# EAGLE design BoardV1 (EAGLE 9.5.0)
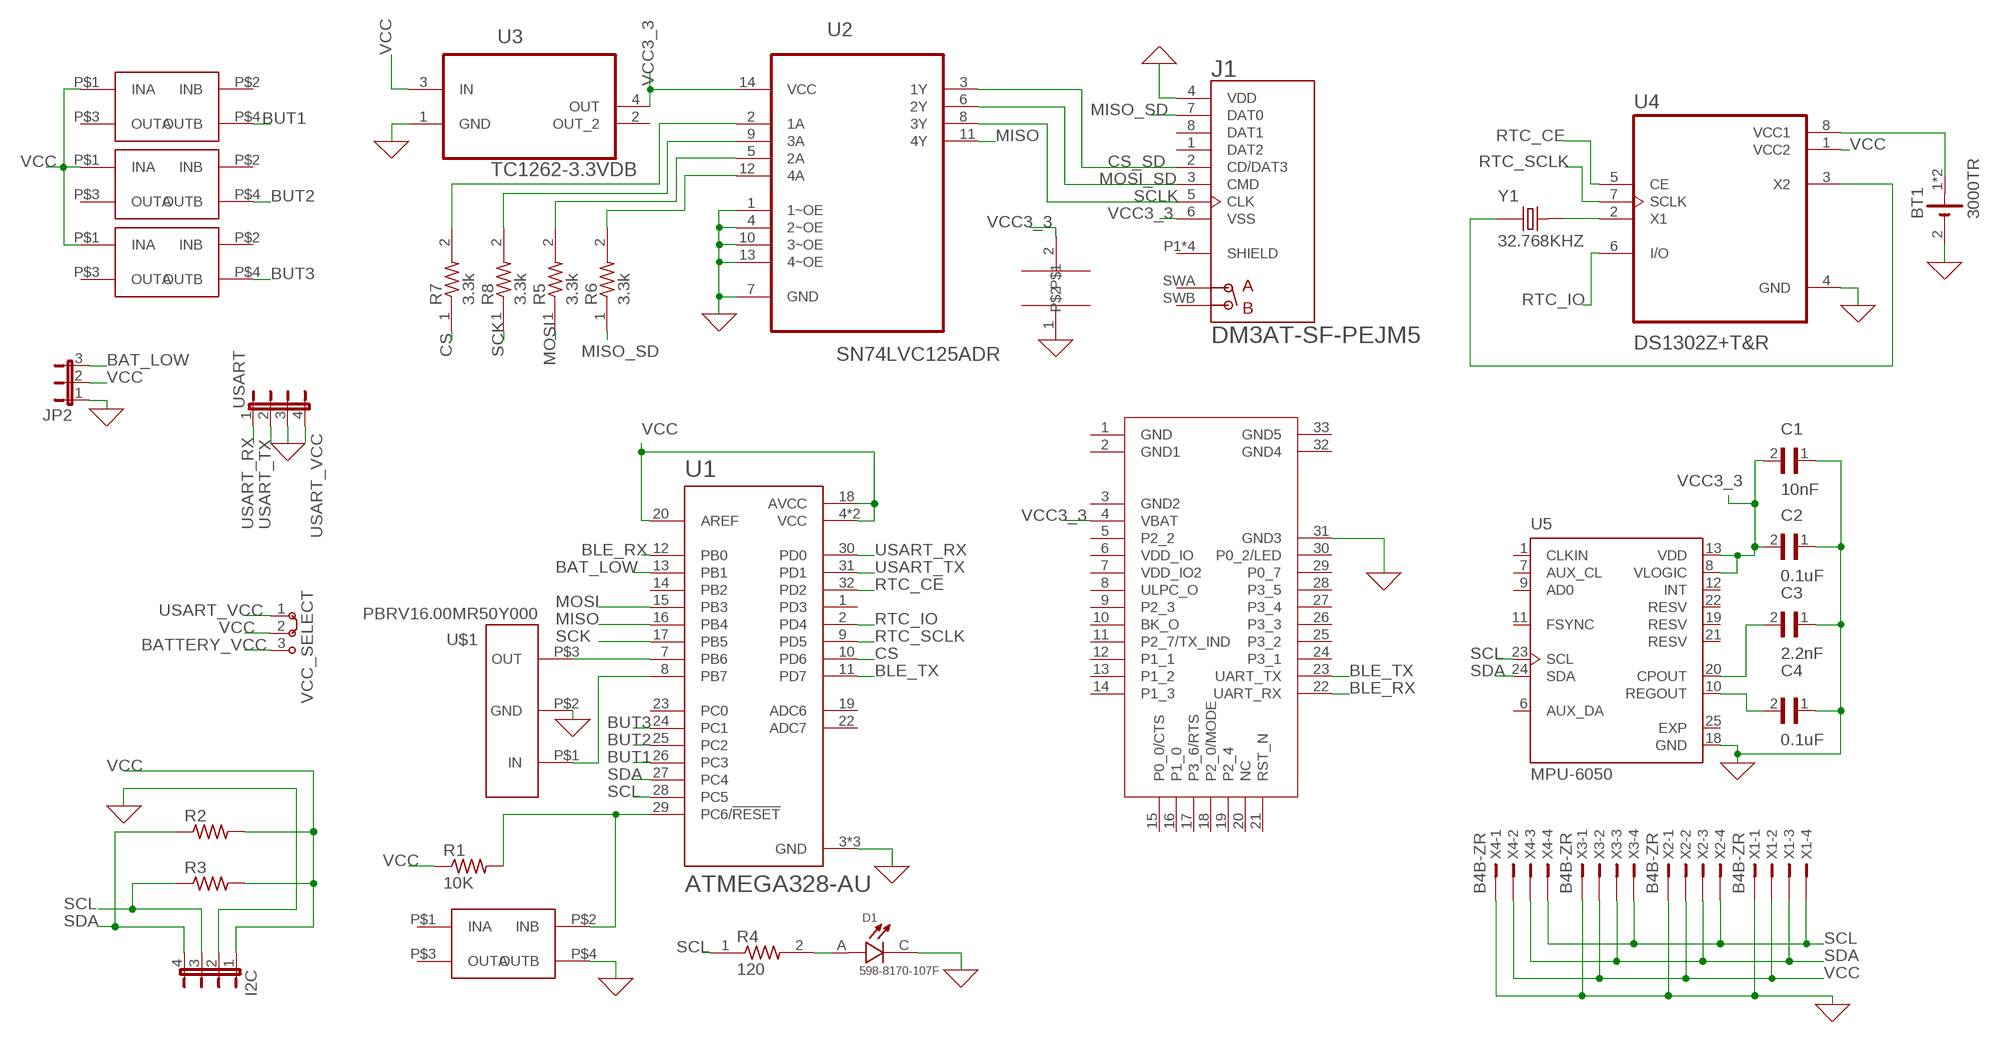
[diagram p0: schematic, sheet 1]

## Parts
BT1  3000TR  [BAT_3000TR]
C1  10nF  08053C225JAT2A  [CAPC2012X140N]
C2  0.1uF  08053C225JAT2A  [CAPC2012X140N]
C3  2.2nF  08053C225JAT2A  [CAPC2012X140N]
C4  0.1uF  08053C225JAT2A  [CAPC2012X140N]
C5  CAPC3225X200N  [CAPC3225X200N]
D1  598-8170-107F  [LEDC2012X70N]
I2C  JP4E  [JP4]
J1  DM3AT-SF-PEJM5  [HRS_DM3AT-SF-PEJM5]
JP2  JP2E  [JP2]
R1  10K  7-1879534-9  [RESC2012X65N]
R2  7-1879534-9  [RESC2012X65N]
R3  7-1879534-9  [RESC2012X65N]
R4  120  MMU01020C4871FB300  [RESC2012X60]
R5  3.3k  MMU01020C4871FB300  [RESC2012X60]
R6  3.3k  MMU01020C4871FB300  [RESC2012X60]
R7  3.3k  MMU01020C4871FB300  [RESC2012X60]
R8  3.3k  MMU01020C4871FB300  [RESC2012X60]
U1  ATMEGA328-AU  [QFP80P900X900X120-32N]
U2  SN74LVC125ADR  [SOIC127P600X175-14N]
U3  TC1262-3.3VDB  ADP3338AKCZ-3.3RL7  [SOT230P700X180-4N]
U4  DS1302Z+T&R  [SOIC127P600X175-8N]
U5  MPU-6050  [QFN50P400X400X95-25N]
U$1  PBRV16.00MR50Y000  [PBRV16.00MR50Y000]
U$2  SPST_SMD  [SPST_SMD]
U$3  SPST_SMD  [SPST_SMD]
U$4  SPST_SMD  [SPST_SMD]
U$5  SPST_SMD  [SPST_SMD]
U$6  RN4870  [MICROCHIP_RN4677-V/RM100]
USART  JP4E  [JP4]
VCC_SELECT  J2X2MM  [04C]
X1  B4B-ZR  [B4B-ZR]
X2  B4B-ZR  [B4B-ZR]
X3  B4B-ZR  [B4B-ZR]
X4  B4B-ZR  [B4B-ZR]
Y1  32.768KHZ  ABS07-32.768KHZ-T  [XTAL_ABS07-32.768KHZ-T]

## Nets
0: BT1.2(-) C1.1 C2.1 C3.1 C4.1 C5.1 D1.C I2C.2 J1.4(VDD) JP2.1 U1.3(GND) U1.5(GND) U1.21(GND) U2.1(1~OE) U2.4(2~OE) U2.7(GND) U2.10(3~OE) U2.13(4~OE) U3.1(GND) U4.4(GND) U5.18(GND) U$1.P$2(GND) U$2.P$4(OUTB) U$6.31(GND3) USART.3 X1.1 X2.1 X3.1 X4.1 ; supply symbol labelled GND
BAT_LOW: JP2.3 U1.13(PB1)
BATTERY_VCC: VCC_SELECT.3
BLE_RX: U1.12(PB0) U$6.22(UART_RX)
BLE_TX: U1.11(PD7) U$6.23(UART_TX)
BUT1: U1.26(PC3) U$3.P$4(OUTB)
BUT2: U1.25(PC2) U$4.P$4(OUTB)
BUT3: U1.24(PC1) U$5.P$4(OUTB)
CS: R7.1 U1.10(PD6)
CS_SD: J1.2(CD/DAT3) U2.3(1Y)
MISO: U1.16(PB4) U2.11(4Y)
MISO_SD: J1.7(DAT0) R6.1
MOSI: R5.1 U1.15(PB3)
MOSI_SD: J1.3(CMD) U2.6(2Y)
N$1: R1.2 U1.29(PC6/!RESET) U$2.P$2(INB)
N$2: U4.2(X1) Y1.2
N$3: U1.8(PB7) U$1.P$1(IN)
N$4: U1.7(PB6) U$1.P$3(OUT)
N$5: U4.3(X2) Y1.1
N$6: BT1.1(+) BT1.3(+) U4.8(VCC1)
N$7: C4.2 U5.10(REGOUT)
N$8: C3.2 U5.20(CPOUT)
N$9: R7.2 U2.2(1A)
N$10: D1.A R4.2
N$11: R8.2 U2.9(3A)
N$12: R5.2 U2.5(2A)
N$13: R6.2 U2.12(4A)
RTC_CE: U1.32(PD2) U4.5(CE)
RTC_IO: U1.2(PD4) U4.6(I/O)
RTC_SCLK: U1.9(PD5) U4.7(SCLK)
SCK: R8.1 U1.17(PB5)
SCL: I2C.3 R3.1 R4.1 U1.28(PC5) U5.23(SCL) X1.4 X2.4 X3.4 X4.4
SCLK: J1.5(CLK) U2.8(3Y)
SDA: I2C.4 R2.1 U1.27(PC4) U5.24(SDA) X1.3 X2.3 X3.3 X4.3
USART_RX: U1.30(PD0) USART.1
USART_TX: U1.31(PD1) USART.2
USART_VCC: USART.4 VCC_SELECT.1
VCC: I2C.1 JP2.2 R1.1 R2.2 R3.2 U1.4(VCC) U1.6(VCC) U1.18(AVCC) U1.20(AREF) U3.3(IN) U4.1(VCC2) U$3.P$1(INA) U$4.P$1(INA) U$5.P$1(INA) VCC_SELECT.2 X1.2 X2.2 X3.2 X4.2
VCC3_3: C1.2 C2.2 C5.2 J1.6(VSS) U2.14(VCC) U3.4(OUT) U5.8(VLOGIC) U5.13(VDD) U$6.4(VBAT)
Unconnected: J1.1(DAT2) J1.8(DAT1) J1.P1(SHIELD) J1.P2(SHIELD) J1.P3(SHIELD) J1.P4(SHIELD) J1.SWA(A) J1.SWB(B) U1.1(PD3) U1.14(PB2) U1.19(ADC6) U1.22(ADC7) U1.23(PC0) U3.2(OUT_2) U5.1(CLKIN) U5.6(AUX_DA) U5.7(AUX_CL) U5.9(AD0) U5.11(FSYNC) U5.12(INT) U5.19(RESV) U5.21(RESV) U5.22(RESV) U$2.P$1(INA) U$2.P$3(OUTA) U$3.P$2(INB) U$3.P$3(OUTA) U$4.P$2(INB) U$4.P$3(OUTA) U$5.P$2(INB) U$5.P$3(OUTA) U$6.1(GND) U$6.2(GND1) U$6.3(GND2) U$6.5(P2_2) U$6.6(VDD_IO) U$6.7(VDD_IO2) U$6.8(ULPC_O) U$6.9(P2_3) U$6.10(BK_O) U$6.11(P2_7/TX_IND) U$6.12(P1_1) U$6.13(P1_2) U$6.14(P1_3) U$6.15(P0_0/CTS) U$6.16(P1_0) U$6.17(P3_6/RTS) U$6.18(P2_0/MODE) U$6.19(P2_4) U$6.20(NC) U$6.21(RST_N) U$6.24(P3_1) U$6.25(P3_2) U$6.26(P3_3) U$6.27(P3_4) U$6.28(P3_5) U$6.29(P0_7) U$6.30(P0_2/LED) U$6.32(GND4) U$6.33(GND5)

## Power pins joined to a net without a drawn wire
EXP: U5.25(EXP)

## Library data of the parts
BT1 = 3000TR:3000TR: Ultra Low Profile SMT Coin Cell Battery Contact Retainer for 12 mm Cell; AVAILABILITY: Unavailable; DESCRIPTION: Ultra Low Profile SMT Coin Cell Battery Contact Retainer for 12 mm Cell; MF: Keystone; MP: 3000TR; PACKAGE: None; PRICE: None
C1-C4 = 0805Cap:08053C225JAT2A; AVAILABILITY: Unavailable; DESCRIPTION: Multilayer Ceramic Capacitors MLCC - SMD/SMT 25V 2.2uF X7R 0805 0.05; MF: AVX; MP: 08053C225JAT2A; PACKAGE: 0805 AVX; PRICE: None
C5 = 1210Cap:CAPC3225X200N; A_MAX: 2.0; A_MIN: 2.0; A_NOM: 2.0; D_MAX: 3.4; D_MIN: 3.0; D_NOM: 3.2; E_MAX: 2.7; E_MIN: 2.3; E_NOM: 2.5; L1_MAX: 1.0; L1_MIN: 0.3; L1_NOM: 0.65; L_MAX: 1.0; L_MIN: 0.3; L_NOM: 0.65; MANUFACTURER: Murata; STANDARD: IPC 7351B
D1 = 0805LED:598-8170-107F: LED, GREEN, 1.25MM X 1.4MM, 20MCD, 570NM; AVAILABILITY: Unavailable; DESCRIPTION: Led; 0805 Smt Led, Green, Alingap, Water Clear Lens, 140 Deg Viewing Angle; MF: Dialight; MP: 598-8170-107F; PACKAGE: 0805 Dialight; PRICE: None
I2C USART = jumper:JP4E: JUMPER
J1 = DM3AT-SF-PEJM5:DM3AT-SF-PEJM5: DM3 Series 8 Position Right Angle SMT Push Push Ejection MicroSD Card Connector; AVAILABILITY: Unavailable; DESCRIPTION: DM3 RA SMT microSD memory card push/push; MF: Hirose; MP: DM3AT-SF-PEJM5; PACKAGE: None; PRICE: None
JP2 = jumper:JP2E: JUMPER
R1-R3 = 7-1879534-9:7-1879534-9: CRGV0805 1% 649K 800V; AVAILABILITY: Unavailable; COMMENT: 7-1879534-9; DESCRIPTION: CRGV0805 1% 649K 800V; EU_ROHS_COMPLIANCE: Compliant with Exemptions; MF: TE Connectivity; MP: 7-1879534-9; PACKAGE: 0805; POWER_RATING: .125 W; PRICE: None; RESISTANCE: 649K; TE_PURCHASE_URL: https://www.te.com/usa-en/product-7-1879534-9.html?te_bu=Cor&te_type=disp&te_campaign=seda_glo_cor-seda-global-disp-prtnr-fy19-seda-model-bom-cta_sma-317_1&elqCampaignId=32493; TOLERANCE: 1%; VOLTAGE_RATING: 150 V
R4-R8 = 0805Res:MMU01020C4871FB300: SMD Resistor [Vishay] MMU01020C4871FB300 SMD Resistor; AVAILABILITY: Unavailable; DESCRIPTION: SMD Resistor [Vishay] MMU01020C4871FB300 SMD Resistor; MF: Vishay; MP: MMU01020C4871FB300; PACKAGE: 0805 Vishay; PRICE: None
U1 = ATMEGA328-AU:ATMEGA328-AU: ATmega Series 20 MHz 32 KB Flash 2 KB SRAM 8-Bit Microcontroller - TQFP-32; AVAILABILITY: Unavailable; DESCRIPTION: ATmega Series 20 MHz 32 KB Flash 2 KB SRAM 8-Bit Microcontroller - TQFP-32; MF: Microchip; MP: ATMEGA328-AU; PACKAGE: TQFP-32 Microchip; PRICE: None
U2 = SN74LVC125ADR:SN74LVC125ADR: QUADRUPLE BUS BUFFER GATE WITH 3-STATE OUTPUTS; DESCRIPTION: Quadruple Bus Buffer Gate With 3-State Outputs 14-SOIC -40 to 125; DIGI-KEY_PART_NUMBER: 296-8453-1-ND; DIGI-KEY_PURCHASE_URL: https://www.digikey.com/product-detail/en/texas-instruments/SN74LVC125ADR/296-8453-1-ND/377412?utm_source=snapeda&utm_medium=aggregator&utm_campaign=symbol; MF: Texas Instruments; MP: SN74LVC125ADR; PACKAGE: SOIC-14 Texas Instruments
U3 = ADP3338AKCZ-3.3RL7:ADP3338AKCZ-3.3RL7: Low Dropout Regulator; AVAILABILITY: Unavailable; DESCRIPTION: LDO Regulator Pos 3.3V 1.6A 4-Pin_3+Tab_ SOT-223 T/R; MF: Analog Devices; MP: ADP3338AKCZ-3.3RL7; PACKAGE: SOT-223 Analog Devices; PRICE: None
U4 = DS1302Z_T_R:DS1302Z+T&R; AVAILABILITY: Unavailable; DESCRIPTION: Real Time Clock Serial 31Byte 8-Pin SOIC N T/R; MF: Maxim Integrated; MP: DS1302Z+T&amp;R; PACKAGE: SOIC-8 Maxim; PRICE: None
U5 = MPU-6050:MPU-6050: MPU-6050 Six-Axis (Gyro + Accelerometer) MEMS MotionTracking™ Devices; AVAILABILITY: Unavailable; DESCRIPTION: Is the world’s first integrated 6-axis MotionTracking device that combines a 3-axis gyroscope, 3-axis accelerometer, and a Digital Motion Processor™ _DMP_ all in a small 4x4x0.9mm Package.; MF: TDK InvenSense; MP: MPU6050; PACKAGE: VFQFN-24 TDK InvenSense; PRICE: None
U$1 = PBRV16.00MR50Y000:PBRV16.00MR50Y000
U$2-U$5 = SPST_SMD:SPST_SMD
U$6 = MICROCHIP_RN4677-V_RM100:RN4870
VCC_SELECT = jumper:J2: Jumper switch 2 x 2.5 mm
X1-X4 = con-jst:?4B-ZR: ZH CONNECTOR 1.5 mm, 4 pin 1 row Source: http://www.jst.com .. eZH.pdf; MF: FARNELL; MPN: B4B-ZR(LF)(SN); OC_FARNELL: 1830916; OC_NEWARK: 37K9960
Y1 = ABS07-32.768KHZ-T:ABS07-32.768KHZ-T: ABS07 Series 32.768 kHz ±20 ppm 12.5 pF -40 to +85 °C SMT Low Profile Crystal; AVAILABILITY: Unavailable; DESCRIPTION: Crystal 0.032768MHz ±20ppm _Tol_ 12.5pF 70000Ohm 2-Pin CSMD Bulk; MF: Abracon LLC; MP: ABS07-32.768KHZ; PACKAGE: SMD-2 Abracon; PRICE: None

## Board
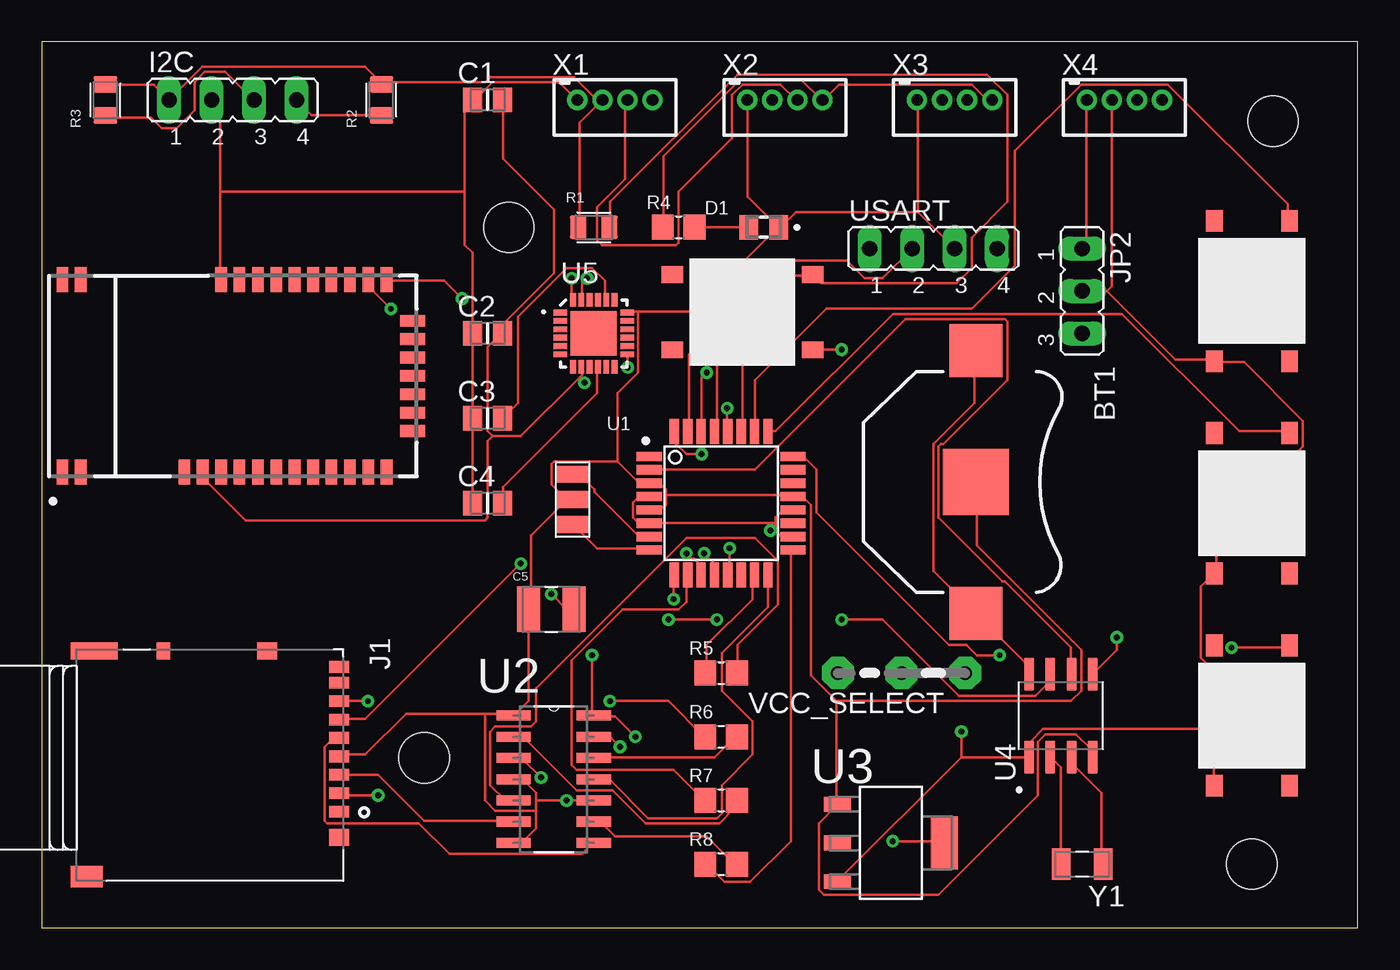
[diagram p1: board, top side]
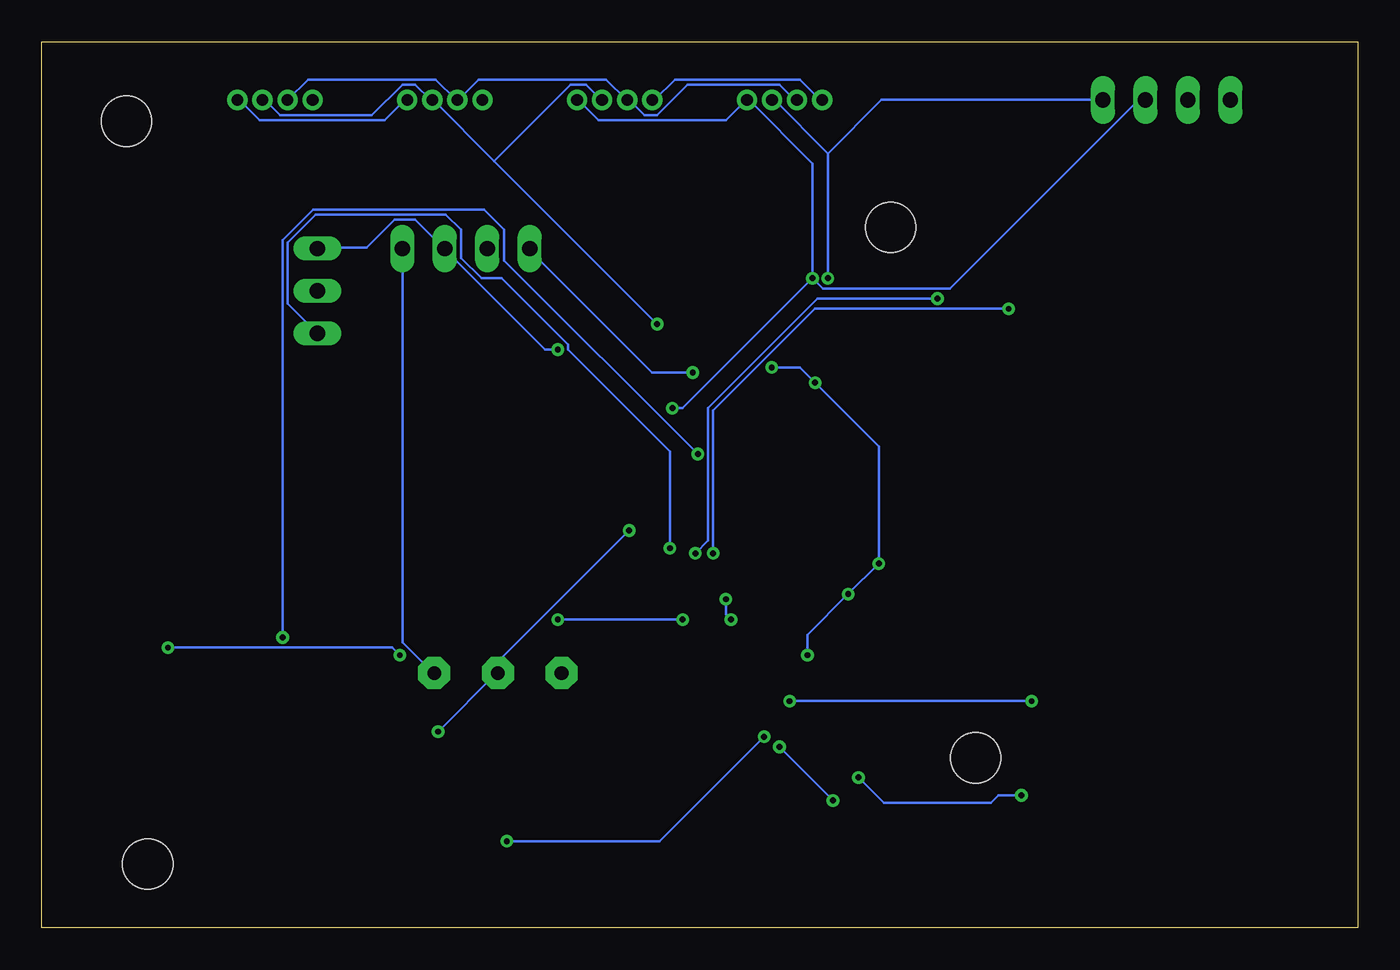
[diagram p2: board, bottom side, seen from below]

Size 78.72 x 53.01 mm. Coordinates in mm from the lower left corner, seen from the top.
Outline: 0,0 78.72,0 78.72,53.01 0,53.01 0,0
Copper layers (1*16): Top 0.035mm / dielectric 1.5mm / Bottom 0.035mm
Design rules "default": minimum track width 6mil, minimum drill 0.35mm, track to track 6mil, track to pad 6mil, pad to pad 6mil, via to via 6mil, smd to smd 6mil, copper to edge 40mil, drill to drill 6mil, minimum pad ring 10mil, minimum via ring 8mil, stop-mask expansion 4mil, vias tented up to drill 0mil, thermal gap 10mil
Holes 3 mm at 73.66,48.26 22.86,10.16 27.94,41.91 72.39,3.81

### Footprints (pad centres in the part's own frame; a part is rotated, then mirrored left to right if it is on the bottom)
BAT_3000TR = smd 3.18 x 3.18: 1 -7.87,0; 3 7.87,0 | smd 3.96 x 3.96: 2 0,0
CAPC2012X140N = smd 1.15 x 1.45: 1 -0.9,0; 2 0.9,0
CAPC3225X200N = smd 1.38 x 2.72: 1 -1.369,0; 2 1.369,0
LEDC2012X70N = smd 1.1 x 1.45: A 0.9,0; C -0.9,0
JP4 = drill 0.914 long: 1 -3.81,0; 2 -1.27,0; 3 1.27,0; 4 3.81,0
HRS_DM3AT-SF-PEJM5 = smd 0.7 x 1.2: 1 3.2,0; 2 2.1,0; 3 1,0; 4 -0.1,0; 5 -1.2,0; 6 -2.3,0; 7 -3.4,0; 8 -4.5,0; SWB -5.45,0 | smd 1 x 1.2: P1 -6.4,-4.3; P4 4.75,0 | smd 1 x 2.8: P2 -6.4,-14.65 | smd 1.3 x 1.9: P3 7.1,-15.1 | smd 1 x 0.8: SWA -6.4,-10.5
JP2 = drill 0.914 long: 1 -2.54,0; 2 0,0; 3 2.54,0
RESC2012X65N = smd 1 x 1.42: 1 -0.935,0; 2 0.935,0
RESC2012X60 = smd 1.3 x 1.5: 1 -0.95,0; 2 0.95,0
QFP80P900X900X120-32N = smd 1.5 x 0.55: 1 -4.3,2.8; 2 -4.3,2; 3 -4.3,1.2; 4 -4.3,0.4; 5 -4.3,-0.4; 6 -4.3,-1.2; 7 -4.3,-2; 8 -4.3,-2.8; 17 4.3,-2.8; 18 4.3,-2; 19 4.3,-1.2; 20 4.3,-0.4; 21 4.3,0.4; 22 4.3,1.2; 23 4.3,2; 24 4.3,2.8 | smd 0.55 x 1.5: 9 -2.8,-4.3; 10 -2,-4.3; 11 -1.2,-4.3; 12 -0.4,-4.3; 13 0.4,-4.3; 14 1.2,-4.3; 15 2,-4.3; 16 2.8,-4.3; 25 2.8,4.3; 26 2,4.3; 27 1.2,4.3; 28 0.4,4.3; 29 -0.4,4.3; 30 -1.2,4.3; 31 -2,4.3; 32 -2.8,4.3
SOIC127P600X175-14N = smd 2.057 x 0.61: 1 -4.801,7.62; 2 -4.801,6.35; 3 -4.801,5.08; 4 -4.801,3.81; 5 -4.801,2.54; 6 -4.801,1.27; 7 -4.801,0; 8 0,0; 9 0,1.27; 10 0,2.54; 11 0,3.81; 12 0,5.08; 13 0,6.35; 14 0,7.62
SOT230P700X180-4N = smd 1.626 x 0.889: 1 -3.2,2.311; 2 -3.2,0; 3 -3.2,-2.311 | smd 1.626 x 3.175: 4 3.2,0
SOIC127P600X175-8N = smd 1.97 x 0.59: 1 -2.475,1.905; 2 -2.475,0.635; 3 -2.475,-0.635; 4 -2.475,-1.905; 5 2.475,-1.905; 6 2.475,-0.635; 7 2.475,0.635; 8 2.475,1.905
QFN50P400X400X95-25N = smd 0.8 x 0.35: 1 -2,1.25; 2 -2,0.75; 3 -2,0.25; 4 -2,-0.25; 5 -2,-0.75; 6 -2,-1.25; 13 2,-1.25; 14 2,-0.75; 15 2,-0.25; 16 2,0.25; 17 2,0.75; 18 2,1.25 | smd 0.35 x 0.8: 7 -1.25,-2; 8 -0.75,-2; 9 -0.25,-2; 10 0.25,-2; 11 0.75,-2; 12 1.25,-2; 19 1.25,2; 20 0.75,2; 21 0.25,2; 22 -0.25,2; 23 -0.75,2; 24 -1.25,2 | smd 2.75 x 2.65: 25 0,0
PBRV16.00MR50Y000 = smd 1 x 2: P$1 0,0; P$2 1.5,0; P$3 3,0
SPST_SMD = smd 1.3 x 1: P$1 -4.2,2.25; P$2 4.2,2.25; P$3 -4.2,-2.25; P$4 4.2,-2.25
MICROCHIP_RN4677-V/RM100 = smd 1.5 x 0.7: 1 -5.75,10.2; 2 -5.75,9.1; 3 -5.75,2.9; 4 -5.75,1.8; 5 -5.75,0.7; 6 -5.75,-0.4; 7 -5.75,-1.5; 8 -5.75,-2.6; 9 -5.75,-3.7; 10 -5.75,-4.8; 11 -5.75,-5.9; 12 -5.75,-7; 13 -5.75,-8.1; 14 -5.75,-9.2; 22 5.75,-9.2; 23 5.75,-8.1; 24 5.75,-7; 25 5.75,-5.9; 26 5.75,-4.8; 27 5.75,-3.7; 28 5.75,-2.6; 29 5.75,-1.5; 30 5.75,-0.4; 31 5.75,0.7; 32 5.75,9.1; 33 5.75,10.2 | smd 0.7 x 1.5: 15 -3.3,-10.75; 16 -2.2,-10.75; 17 -1.1,-10.75; 18 0,-10.75; 19 1.1,-10.75; 20 2.2,-10.75; 21 3.3,-10.75
04C = drill 0.813 pad 1.905 octagon: 1 -1.905,0; 2 1.905,0; 3 5.715,0
B4B-ZR = drill 0.7 pad 1.1: 1 -2.25,0; 2 -0.75,0; 3 0.75,0; 4 2.25,0
XTAL_ABS07-32.768KHZ-T = smd 1.1 x 1.9: 1 -1.25,0; 2 1.25,0

### Placement (x,y rotation side)
BT1  55.88,26.67 270 top
C1  26.67,49.53 0 top
C2  26.67,35.56 0 top
C3  26.67,30.48 0 top
C4  26.67,25.4 0 top
C5  30.48,19.05 0 top
D1  43.18,41.91 180 top
I2C  11.43,49.53 0 top
J1  17.78,10.16 270 top
JP2  62.23,38.1 270 top
R1  33.02,41.91 0 top
R2  20.32,49.53 90 top
R3  3.81,49.53 90 top
R4  38.1,41.91 0 top
R5  40.64,15.24 0 top
R6  40.64,11.43 0 top
R7  40.64,7.62 0 top
R8  40.64,3.81 0 top
U1  40.64,25.4 0 top
U2  33.02,5.08 0 top
U3  50.8,5.08 0 top
U4  60.96,12.7 90 top
U5  33.02,35.56 0 top
U$1  31.75,24.13 90 top
U$2  41.91,36.83 0 top
U$3  72.39,38.1 90 top
U$4  72.39,25.4 90 top
U$5  72.39,12.7 90 top
U$6  11.43,33.02 90 top
USART  53.34,40.64 0 top
VCC_SELECT  53.34,15.24 180 top
X1  34.29,49.53 0 top
X2  44.45,49.53 0 top
X3  54.61,49.53 0 top
X4  64.77,49.53 0 top
Y1  62.23,3.81 180 top

### Tracks (layer width: path | path; a pad name or v marks a point on that pad's centre or on a via)
0  (via drill 0.35)
  Top 0.152: 29.57,7.62 29.57,8.08 28.8,8.84 28.35,8.84 U2.4 | 29.57,7.62 29.57,7.01 | 29.57,7.01 29.57,5.94 28.8,5.18 28.35,5.18 U2.7 | 29.57,7.62 v31.39,7.62 U2.10 | U2.13 33.98,11.43 v34.59,10.82 | 31.39,25.6 31.7,25.6 U$1.P$2 31.39,25.6 | 31.39,25.6 29.26,23.47 29.26,19.05 C5.1 29.11,13.56 28.35,12.8 U2.1 28.19,12.8 26.52,12.8 | 26.52,12.8 21.79,12.8 19.36,10.36 17.83,10.36 J1.4 | 29.57,7.01 27.13,7.01 26.52,7.62 26.52,12.8 | 37.34,25.91 37.34,26.21 37.03,26.52 36.42,26.52 U1.3 36.27,26.67 35.66,26.67 34.44,27.89 | 37.34,25.91 37.34,25.3 37.19,25.15 36.42,25.15 U1.5 | 37.34,25.91 44.81,25.91 U1.21 44.96,25.76 45.57,25.76 46.02,25.3 46.02,15.09 47.55,13.56 | 47.55,13.56 47.55,7.47 U3.1 47.55,7.32 46.48,6.25 46.48,2.29 46.79,1.98 53.65,1.98 59.59,7.92 59.59,11.12 60.05,11.58 61.87,11.58 62.79,10.67 62.79,10.36 U4.4 | 47.55,13.56 61.57,13.56 62.18,14.17 62.18,16.61 55.93,22.86 55.93,26.67 BT1.2 | 31.39,25.6 30.48,26.52 30.48,27.74 30.63,27.89 34.44,27.89 | X4.1 62.48,49.53 62.48,40.84 62.33,40.69 JP2.1 | v47.85,34.59 46.18,34.59 U$2.P$4 | 52.43,42.82 52.43,49.53 X3.1 | USART.3 52.43,42.82 | 10.67,44.04 10.67,49.07 10.21,49.53 I2C.2 | 10.67,44.04 10.67,38.86 U$6.31 | 25.76,30.48 25.76,25.45 C4.1 | 25.76,30.48 25.76,35.51 C2.1 25.76,35.66 25.76,40.39 25.3,40.84 25.3,44.04 | 25.76,30.48 C3.1 | X1.1 32,49.53 30.94,50.6 26.98,50.6 25.91,49.53 C1.1 25.76,49.53 25.3,49.07 25.3,44.04 | 35.66,36.88 39.01,36.88 44.04,41.91 | 35.66,36.88 35.05,36.88 U5.18 | 44.04,41.91 42.22,43.74 42.22,49.53 X2.1 | 44.04,41.91 D1.C 44.2,41.91 45.11,42.82 52.43,42.82 | 25.3,44.04 10.67,44.04 | 34.44,27.89 34.44,32 35.66,33.22 35.66,36.88
  Bottom 0.152: v31.39,7.62 v34.59,10.82 | v47.85,34.59 48.62,34.59 54.56,40.54 USART.3 54.71,40.69 56.39,42.37 57.61,42.37 59.28,40.69 62.18,40.69 JP2.1 | X1.1 32.16,49.53 33.38,50.75 40.84,50.75 42.06,49.53 X2.1
BAT_LOW  (via drill 0.35)
  Top 0.152: v41.15,22.71 41.15,21.18 U1.13
  Bottom 0.152: v41.15,22.71 41.15,28.5 47.24,34.59 47.24,34.9 51.21,38.86 52.43,38.86 53.65,40.08 53.65,41.76 54.56,42.67 62.33,42.67 64.01,41 64.01,37.34 JP2.3
BLE_RX  (via drill 0.35)
  Top 0.152: v25.15,37.64 24.08,38.71 20.73,38.71 U$6.22 | v39.62,22.4 40.23,21.79 40.23,21.18 U1.12
  Bottom 0.152: v25.15,37.64 32.31,37.64 38.86,31.09 38.86,23.16 v39.62,22.4
BLE_TX  (via drill 0.35)
  Top 0.152: v20.88,37.03 19.66,38.25 19.66,38.71 U$6.23 | v38.56,22.4 38.86,22.1 39.01,22.1 39.32,21.79 39.32,21.18 U1.11
  Bottom 0.152: v20.88,37.03 32.46,37.03 38.56,30.94 v38.56,22.4
BUT1
  Top 0.152: U$3.P$4 74.52,42.37 74.52,43.28 67.36,50.44 62.18,50.44 58.22,46.48 58.22,39.62 55.63,37.03 46.94,37.03 42.67,32.77 42.67,29.72 U1.26
BUT2
  Top 0.152: U$4.P$4 74.52,29.72 71.63,29.72 64.62,36.73 50.9,36.73 43.89,29.72 43.59,29.72 U1.25
BUT3  (via drill 0.35)
  Top 0.152: v71.17,16.76 74.52,16.76 U$5.P$4 | v57.3,16.31 55.93,16.31 55.32,16.92 54.25,16.92 46.33,24.84 46.33,27.43 45.57,28.19 44.96,28.19 U1.24
  Bottom 0.152: v71.17,16.76 57.76,16.76 v57.3,16.31
CS
  Top 0.152: U1.10 38.56,21.03 38.56,19.51 38.1,19.05 34.75,19.05 31.7,16 31.7,9.75 32,9.45 37.8,9.45 39.62,7.62 R7.1
CS_SD  (via drill 0.35)
  Top 0.152: v20.12,7.92 17.83,7.92 J1.2 | v29.87,8.99 28.8,10.06 28.35,10.06 U2.3
  Bottom 0.152: v20.12,7.92 21.49,7.92 21.95,7.47 28.35,7.47 v29.87,8.99
MISO
  Top 0.152: U1.16 43.43,21.03 43.43,19.2 40.69,16.46 40.69,14.17 42.52,12.34 42.52,10.36 40.69,8.53 40.69,6.86 40.39,6.55 36.27,6.55 33.98,8.84 33.07,8.84 U2.11
MISO_SD  (via drill 0.35)
  Top 0.152: v19.51,13.56 17.83,13.56 J1.7 | v33.98,13.56 37.49,13.56 39.62,11.43 R6.1
  Bottom 0.152: v33.98,13.56 v19.51,13.56
MOSI
  Top 0.152: R5.1 39.78,15.24 39.78,16.92 42.52,19.66 42.52,21.03 U1.15
MOSI_SD
  Top 0.152: J1.3 17.83,9.14 20.12,9.14 22.86,6.4 28.19,6.4 U2.6
N$1
  Top 0.152: U1.29 40.39,29.72 40.39,35.51 43.89,39.01 46.02,39.01 U$2.P$2 46.18,39.01 46.63,38.56 54.71,38.56 55.63,39.47 55.63,41.3 57.76,43.43 57.76,49.84 56.54,51.05 41.6,51.05 33.98,43.43 33.98,41.91 R1.2
N$2
  Top 0.152: Y1.2 60.96,3.81 60.96,9.6 60.35,10.21 U4.2
N$3
  Top 0.152: U1.8 36.27,22.71 33.22,22.71 31.85,24.08 U$1.P$1
N$4
  Top 0.152: U1.7 36.27,23.47 35.66,23.47 33.07,26.06 33.07,26.21 32.16,27.13 31.85,27.13 U$1.P$3
N$5
  Top 0.152: Y1.1 63.4,3.81 63.4,8.08 61.72,9.75 61.72,10.21 U4.3
N$6
  Top 0.152: U4.8 58.98,15.24 58.98,15.7 55.93,18.75 BT1.3 55.78,18.9 53.34,21.34 53.34,28.96 55.78,31.39 55.78,34.44 BT1.1
N$7
  Top 0.152: U5.10 33.22,33.53 33.22,32 27.58,26.36 27.58,25.45 C4.2
N$8
  Top 0.152: U5.20 33.68,37.64 33.68,38.71 32.92,39.47 31.39,39.47 28.5,36.58 28.5,31.39 27.58,30.48 C3.2
N$9
  Top 0.152: U2.2 28.8,11.43 32,8.23 34.14,8.23 36.12,6.25 40.54,6.25 41.45,7.16 41.45,7.62 R7.2
N$10
  Top 0.152: R4.2 D1.A
N$11
  Top 0.152: R8.2 41.45,3.81 39.78,5.49 34.29,5.49 33.53,6.25 33.07,6.25 U2.9
N$12
  Top 0.152: U2.5 27.74,7.62 26.82,8.53 26.82,11.73 27.13,12.04 29.26,12.04 29.57,12.34 29.57,14.33 38.56,23.32 42.67,23.32 44.04,21.95 44.04,19.36 41.6,16.92 41.6,15.24 R5.2
N$13
  Top 0.152: R6.2 41.45,11.43 40.23,10.21 33.07,10.21 U2.12
RTC_CE  (via drill 0.35)
  Top 0.152: v39.47,28.35 38.56,28.35 37.95,28.96 37.95,29.57 U1.32 | v64.31,17.37 64.31,16.61 62.94,15.24 U4.5
  Bottom 0.152: v39.47,28.35 51.05,39.93 51.05,41.76 52.27,42.98 62.48,42.98 64.31,41.15 v64.31,17.37
RTC_IO
  Top 0.152: U1.2 36.42,27.43 42.67,27.43 51.66,36.42 57.61,36.42 57.76,36.27 57.76,32.77 53.95,28.96 53.8,28.96 53.65,28.8 53.65,24.54 57.45,20.73 57.61,20.73 61.57,16.76 61.57,15.24 U4.6
RTC_SCLK  (via drill 0.35)
  Top 0.152: v37.8,19.66 37.8,21.03 U1.9 | v40.39,18.44 v37.49,18.44 | v47.85,18.44 50.29,18.44 54.86,13.87 59.44,13.87 60.2,14.63 60.2,15.09 U4.7
  Bottom 0.152: v37.8,19.66 37.8,18.75 v37.49,18.44 | v47.85,18.44 v40.39,18.44
SCK
  Top 0.152: R8.1 39.78,3.81 40.84,2.74 42.37,2.74 44.81,5.18 44.81,22.55 U1.17
SCL  (via drill 0.35)
  Top 0.152: R4.1 37.19,41.91 37.19,46.18 41.76,50.75 45.41,50.75 46.63,49.53 X2.4 46.79,49.53 47.7,50.44 55.63,50.44 56.54,49.53 X3.4 | R3.1 3.81,48.46 6.55,48.46 7.16,47.85 8.08,47.85 9.14,48.92 9.14,50.6 9.75,51.21 10.97,51.21 12.65,49.53 I2C.3 | v32.61,38.86 32.31,38.56 32.31,37.64 U5.23 | v41,31.09 41,29.72 U1.28
  Bottom 0.152: X4.4 66.9,49.53 65.68,48.31 58.22,48.31 57,49.53 X3.4 | v32.61,38.86 32.61,45.72 36.42,49.53 X1.4 36.58,49.53 37.8,48.31 45.41,48.31 46.63,49.53 X2.4 | v41,31.09 40.39,31.09 v32.61,38.86 | I2C.3 13.11,49.53 24.38,38.25 32,38.25 v32.61,38.86
SCLK
  Top 0.152: J1.5 17.68,11.28 17.37,11.28 16.92,10.82 16.92,6.4 17.07,6.25 22.55,6.25 24.38,4.42 32.31,4.42 32.92,5.03 U2.8
SDA  (via drill 0.35)
  Top 0.152: I2C.4 16.15,48.62 20.27,48.62 R2.1 | v31.7,38.86 31.7,37.64 U5.24 | v41.91,36.12 41.91,29.72 U1.27 | X1.3 34.9,49.53 34.9,44.81 33.22,43.13 33.22,41.15 33.53,40.84 37.95,40.84 38.1,41 38.1,44.04 41.3,47.24 41.3,49.84 41.91,50.44 44.2,50.44 45.11,49.53 X2.3
  Bottom 0.152: 31.7,46.33 v31.7,38.86 | 31.7,46.33 34.9,49.53 X1.3 | I2C.4 28.5,49.53 31.7,46.33 | 51.66,45.87 55.32,49.53 X3.3 55.47,49.53 56.39,50.44 57.15,50.44 58.98,48.62 64.47,48.62 65.38,49.53 X4.3 | 51.66,45.87 v41.91,36.12 | 51.66,45.87 47.09,50.44 46.18,50.44 45.26,49.53 X2.3
USART_RX  (via drill 0.35)
  Top 0.152: v39.78,33.22 39.47,32.92 39.47,29.72 U1.30
  Bottom 0.152: v39.78,33.22 42.22,33.22 49.53,40.54 USART.1
USART_TX
  Top 0.152: USART.2 50.29,38.86 49.23,38.86 48.16,39.93 44.35,39.93 38.71,34.29 38.71,29.72 U1.31
USART_VCC
  Bottom 0.152: USART.4 57.15,17.07 55.32,15.24 VCC_SELECT.1
VCC  (via drill 0.35)
  Top 0.152: 70.1,11.89 70.1,15.39 69.34,16.15 69.34,20.42 70.1,21.18 U$4.P$1 70.26,21.34 70.26,23.62 75.44,28.8 75.44,30.33 71.93,33.83 70.26,33.83 U$3.P$1 70.1,33.98 67.82,33.98 63.7,38.1 | 70.1,11.89 70.1,8.53 U$5.P$1 | U1.4 36.27,25.76 35.66,25.76 35.36,25.45 35.36,24.54 35.66,24.23 36.27,24.23 U1.6 36.42,24.23 43.89,24.23 | 43.89,23.77 44.2,23.47 44.81,23.47 U1.18 | 43.89,24.23 43.89,24.54 44.35,24.99 44.81,24.99 U1.20 | 43.89,24.23 43.89,23.77 | 55.02,10.21 47.7,2.9 U3.3 | 55.02,10.21 58.98,10.21 U4.1 59.13,10.36 59.13,11.12 59.89,11.89 70.1,11.89 | 55.02,10.21 v55.02,11.73 | v43.59,23.77 43.89,23.77 | R3.2 3.81,50.44 6.71,50.44 I2C.1 9.6,51.51 19.36,51.51 20.27,50.6 R2.2 20.42,50.6 26.52,50.6 26.82,50.9 31.85,50.9 33.38,49.38 | 33.38,49.38 33.53,49.53 X1.2 33.38,49.38 | 33.38,49.38 32.16,48.16 32.16,41.91 R1.1 | JP2.2 63.7,38.1 | 63.7,38.1 64.01,38.41 64.01,49.53 X4.2
  Bottom 0.152: v55.02,11.73 51.51,15.24 VCC_SELECT.2 51.36,15.24 51.36,16 v43.59,23.77 | X4.2 64.01,49.53 62.79,50.75 55.17,50.75 53.95,49.53 X3.2 53.8,49.53 52.58,50.75 44.96,50.75 43.74,49.53 X2.2 43.59,49.53 42.67,48.62 41.91,48.62 40.08,50.44 34.59,50.44 33.68,49.53 X1.2
VCC3_3  (via drill 0.35)
  Top 0.152: 32.16,32.92 28.65,29.41 26.98,29.41 | 32.16,32.92 32.31,33.07 32.31,33.53 U5.8 | 26.98,29.41 26.67,29.72 26.67,34.75 27.43,35.51 C2.2 27.58,35.66 27.58,36.12 30.63,39.17 30.63,42.98 27.58,46.02 27.58,49.53 C1.2 | v35.05,33.53 35.05,34.29 U5.13 | 32.16,32.92 v32.46,32.61 | v28.65,21.79 19.36,12.5 17.83,12.5 J1.6 | 26.98,29.41 26.67,29.11 26.67,24.54 26.52,24.38 12.19,24.38 9.75,26.82 9.75,27.13 U$6.4 | v32.92,16.31 32.92,12.8 U2.14 33.07,12.65 34.29,12.65 v35.51,11.43 | C5.2 31.39,19.05 v30.48,19.96 | v50.9,5.18 53.95,5.18 U3.4
  Bottom 0.152: v35.05,33.53 33.38,33.53 v32.46,32.61 28.65,28.8 v28.65,21.79 v30.48,19.96 32.92,17.53 v32.92,16.31 | v50.9,5.18 41.76,5.18 v35.51,11.43